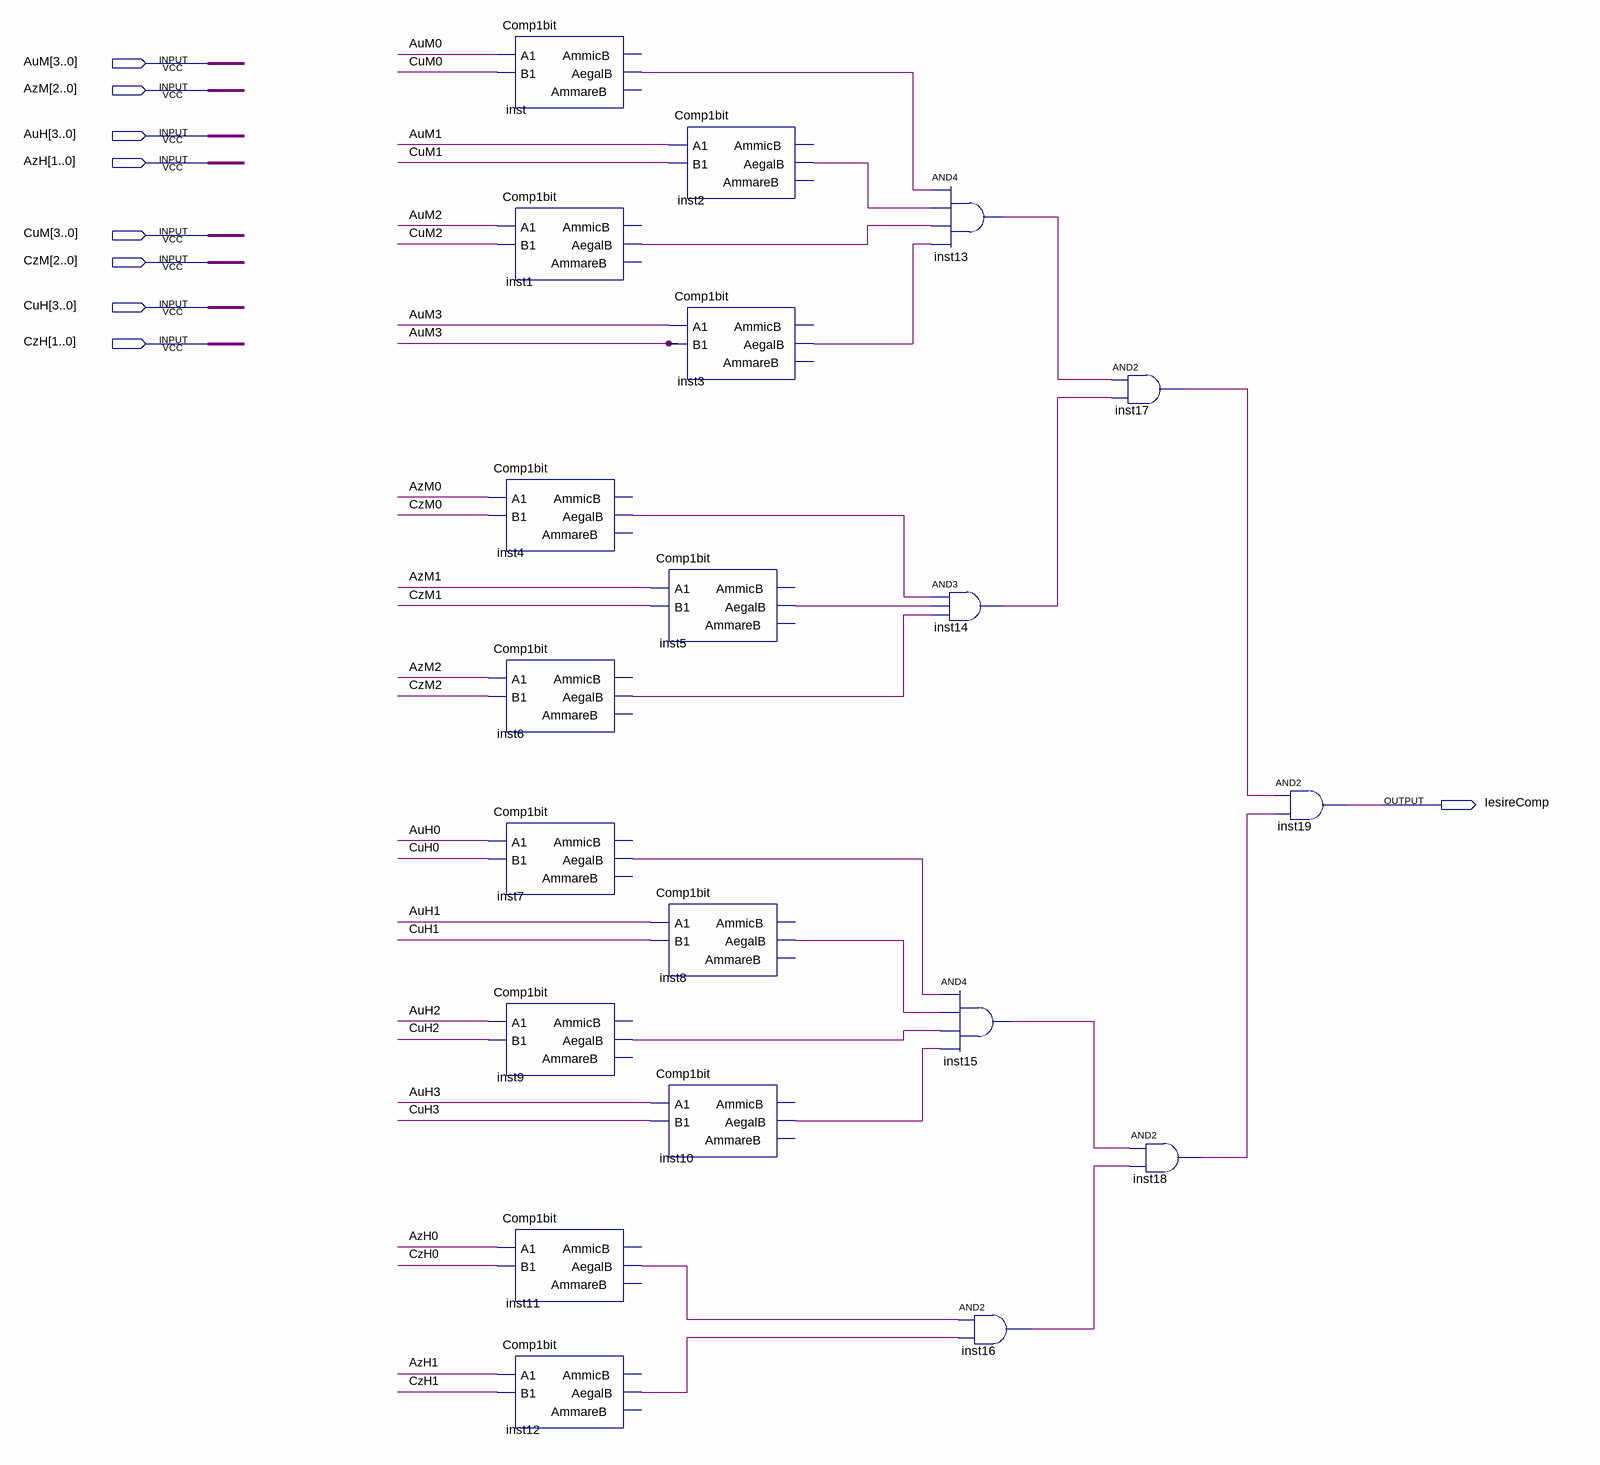
[diagram p0: schematic sheet]
// Quartus schematic Comp13biti.bdf as structural Verilog: 20 symbols, 9 pins
module Comp13biti (
  input  [3:0] AuM,
  input  [2:0] AzM,
  input  [3:0] AuH,
  input  [1:0] AzH,
  input  [3:0] CuM,
  input  [2:0] CzM,
  input  [3:0] CuH,
  input  [1:0] CzH,
  output IesireComp
);

  wire inst1_aegalb, inst2_aegalb, inst3_aegalb, inst4_aegalb, inst5_aegalb, inst6_aegalb, inst7_aegalb,
       inst8_aegalb, inst9_aegalb, inst10_aegalb, inst11_aegalb, inst12_aegalb, inst13_out, inst14_out,
       inst15_out, inst16_out, inst17_out, inst18_out, inst_aegalb;

  Comp1bit inst (.A1(AuM[0]), .B1(CuM[0]), .AegalB(inst_aegalb));  // open: AmmicB, AmmareB
  Comp1bit inst1 (.A1(AuM[2]), .B1(CuM[2]), .AegalB(inst1_aegalb));  // open: AmmicB, AmmareB
  Comp1bit inst4 (.A1(AzM[0]), .B1(CzM[0]), .AegalB(inst4_aegalb));  // open: AmmicB, AmmareB
  Comp1bit inst6 (.A1(AzM[2]), .B1(CzM[2]), .AegalB(inst6_aegalb));  // open: AmmicB, AmmareB
  Comp1bit inst7 (.A1(AuH[0]), .B1(CuH[0]), .AegalB(inst7_aegalb));  // open: AmmicB, AmmareB
  Comp1bit inst9 (.A1(AuH[2]), .B1(CuH[2]), .AegalB(inst9_aegalb));  // open: AmmicB, AmmareB
  Comp1bit inst11 (.A1(AzH[0]), .B1(CzH[0]), .AegalB(inst11_aegalb));  // open: AmmicB, AmmareB
  Comp1bit inst12 (.A1(AzH[1]), .B1(CzH[1]), .AegalB(inst12_aegalb));  // open: AmmicB, AmmareB
  Comp1bit inst2 (.A1(AuM[1]), .B1(CuM[1]), .AegalB(inst2_aegalb));  // open: AmmicB, AmmareB
  Comp1bit inst3 (.A1(AuM[3]), .B1(AuM[3]), .AegalB(inst3_aegalb));  // open: AmmicB, AmmareB
  Comp1bit inst5 (.A1(AzM[1]), .B1(CzM[1]), .AegalB(inst5_aegalb));  // open: AmmicB, AmmareB
  Comp1bit inst8 (.A1(AuH[1]), .B1(CuH[1]), .AegalB(inst8_aegalb));  // open: AmmicB, AmmareB
  Comp1bit inst10 (.A1(AuH[3]), .B1(CuH[3]), .AegalB(inst10_aegalb));  // open: AmmicB, AmmareB
  and inst13 (inst13_out, inst_aegalb, inst2_aegalb, inst1_aegalb, inst3_aegalb);
  and inst14 (inst14_out, inst4_aegalb, inst5_aegalb, inst6_aegalb);
  and inst15 (inst15_out, inst7_aegalb, inst8_aegalb, inst9_aegalb, inst10_aegalb);
  and inst16 (inst16_out, inst11_aegalb, inst12_aegalb);
  and inst17 (inst17_out, inst13_out, inst14_out);
  and inst18 (inst18_out, inst15_out, inst16_out);
  and inst19 (IesireComp, inst17_out, inst18_out);
endmodule
